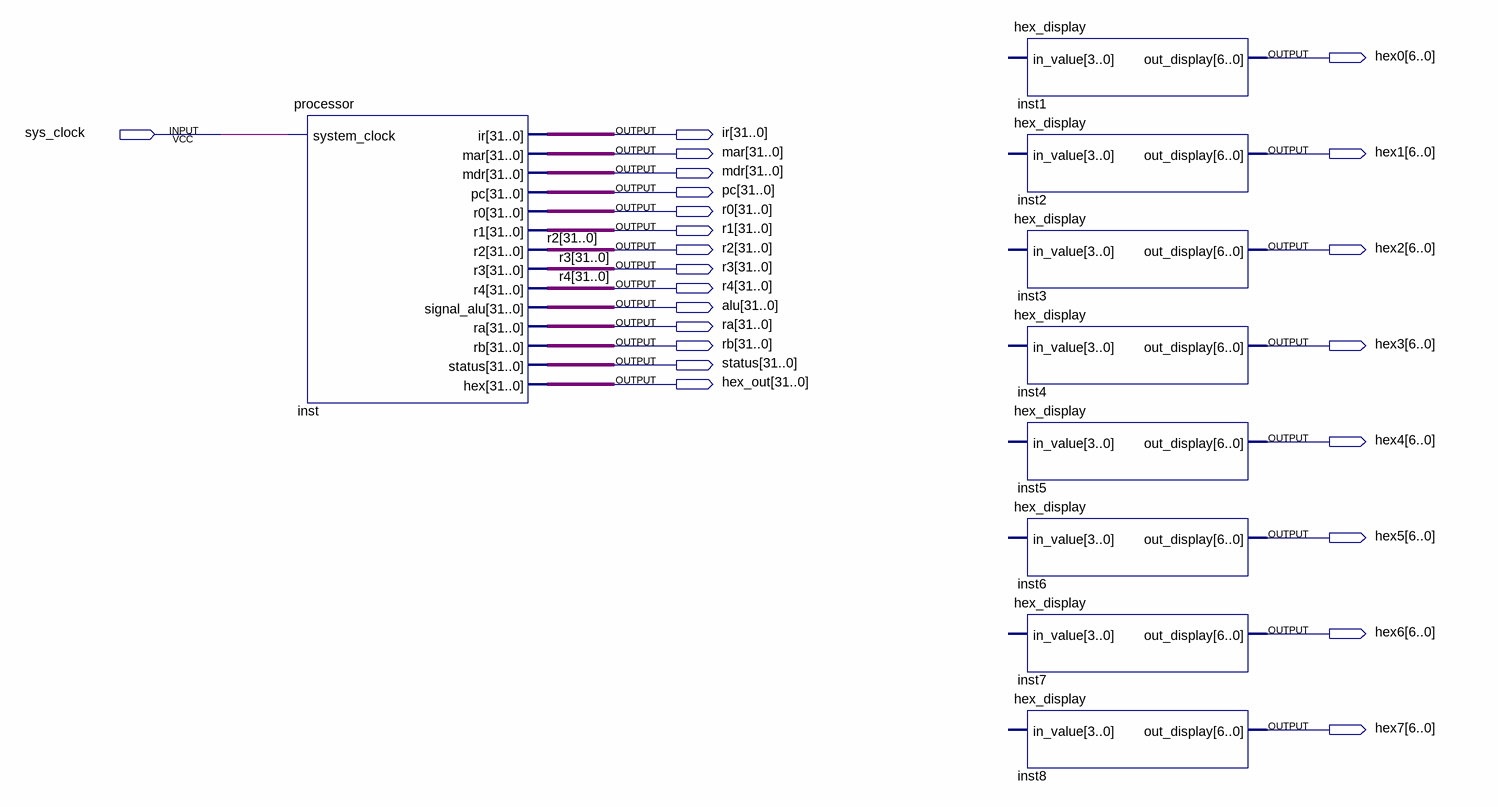
[diagram p0: schematic sheet]
// Quartus schematic backup.bdf as structural Verilog: 9 symbols, 23 pins
module backup (
  input  sys_clock,
  output [6:0] hex0,
  output [31:0] ir,
  output [31:0] mar,
  output [6:0] hex1,
  output [31:0] mdr,
  output [31:0] pc,
  output [31:0] r0,
  output [31:0] r1,
  output [31:0] r2,
  output [6:0] hex2,
  output [31:0] r3,
  output [31:0] r4,
  output [31:0] alu,
  output [31:0] ra,
  output [31:0] rb,
  output [6:0] hex3,
  output [31:0] status,
  output [31:0] hex_out,
  output [6:0] hex4,
  output [6:0] hex5,
  output [6:0] hex6,
  output [6:0] hex7
);

  processor inst (
    .system_clock(sys_clock), .ir(ir), .mar(mar), .mdr(mdr), .pc(pc), .r0(r0), .r1(r1), .r2(r2), .r3(r3),
    .r4(r4), .signal_alu(alu), .ra(ra), .rb(rb), .status(status), .hex(hex_out));
  hex_display inst1 (.out_display(hex0));  // open: in_value
  hex_display inst2 (.out_display(hex1));  // open: in_value
  hex_display inst3 (.out_display(hex2));  // open: in_value
  hex_display inst4 (.out_display(hex3));  // open: in_value
  hex_display inst5 (.out_display(hex4));  // open: in_value
  hex_display inst6 (.out_display(hex5));  // open: in_value
  hex_display inst7 (.out_display(hex6));  // open: in_value
  hex_display inst8 (.out_display(hex7));  // open: in_value
endmodule
